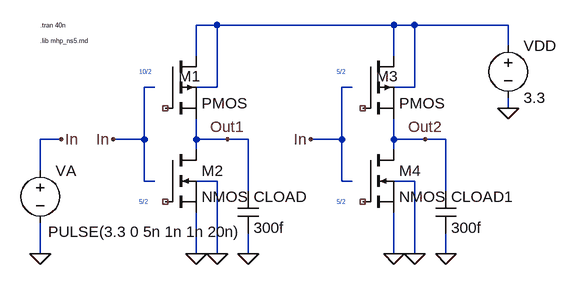
[diagram p0: schematic inv_sym.asc]
inv_sym.asc, the LTspice schematic file:
Version 4
SHEET 1 1292 680
WIRE -592 -96 -624 -96
WIRE -320 -96 -592 -96
WIRE -288 -96 -320 -96
WIRE -144 -96 -288 -96
WIRE -144 -64 -144 -96
WIRE -624 -48 -624 -96
WIRE -320 -48 -320 -96
WIRE -688 0 -704 0
WIRE -592 0 -592 -96
WIRE -592 0 -624 0
WIRE -384 0 -400 0
WIRE -288 0 -288 -96
WIRE -288 0 -320 0
WIRE -144 32 -144 16
WIRE -832 80 -864 80
WIRE -704 80 -704 0
WIRE -704 80 -752 80
WIRE -624 80 -624 48
WIRE -576 80 -624 80
WIRE -544 80 -576 80
WIRE -400 80 -400 0
WIRE -400 80 -448 80
WIRE -320 80 -320 48
WIRE -272 80 -320 80
WIRE -240 80 -272 80
WIRE -624 96 -624 80
WIRE -320 96 -320 80
WIRE -864 128 -864 80
WIRE -704 144 -704 80
WIRE -688 144 -704 144
WIRE -592 144 -624 144
WIRE -400 144 -400 80
WIRE -384 144 -400 144
WIRE -288 144 -320 144
WIRE -544 160 -544 80
WIRE -240 160 -240 80
WIRE -864 256 -864 208
WIRE -624 256 -624 192
WIRE -592 256 -592 144
WIRE -544 256 -544 224
WIRE -320 256 -320 192
WIRE -288 256 -288 144
WIRE -240 256 -240 224
FLAG -624 256 0
FLAG -144 32 0
FLAG -832 80 In
FLAG -592 256 0
FLAG -864 256 0
FLAG -544 256 0
FLAG -752 80 In
FLAG -320 256 0
FLAG -288 256 0
FLAG -240 256 0
FLAG -448 80 In
FLAG -576 80 Out1
FLAG -272 80 Out2
SYMBOL voltage -144 -80 R0
WINDOW 123 0 0 Left 2
WINDOW 39 0 0 Left 2
SYMATTR InstName VDD
SYMATTR Value 3.3
SYMBOL voltage -864 112 R0
WINDOW 123 0 0 Left 2
WINDOW 39 0 0 Left 2
WINDOW 3 12 110 Left 2
SYMATTR Value PULSE(3.3 0 5n 1n 1n 20n)
SYMATTR InstName VA
SYMBOL cap -560 160 R0
SYMATTR InstName CLOAD
SYMATTR Value 300f
SYMBOL pmos -672 -48 R0
WINDOW 0 21 31 Left 2
SYMATTR InstName M1
SYMATTR Value2 l=0.6u w=3u
SYMATTR SpiceModel ""
SYMATTR Value PMOS
SYMBOL nmos -672 96 R0
SYMATTR InstName M2
SYMATTR Value NMOS
SYMATTR Value2 l=0.6u w=1.5u
SYMBOL cap -256 160 R0
SYMATTR InstName CLOAD1
SYMATTR Value 300f
SYMBOL pmos -368 -48 R0
WINDOW 0 21 31 Left 2
SYMATTR InstName M3
SYMATTR Value2 l=0.6u w=1.5u
SYMATTR SpiceModel ""
SYMATTR Value PMOS
SYMBOL nmos -368 96 R0
SYMATTR InstName M4
SYMATTR Value NMOS
SYMATTR Value2 l=0.6u w=1.5u
TEXT -864 -96 Left 0 !.tran 40n
TEXT -864 -72 Left 0 !.lib mhp_ns5.md
TEXT -712 -24 Left 0 ;10/2
TEXT -712 176 Left 0 ;5/2
TEXT -408 -24 Left 0 ;5/2
TEXT -408 176 Left 0 ;5/2

The netlist it stands for:
* inv_sym.asc
VDD N001 0 3.3
VA In 0 PULSE(3.3 0 5n 1n 1n 20n)
CLOAD Out1 0 300f
* M1: PMOS l=0.6u w=3u (symbol pmos not certain, pin order unknown); nets seen at it: N001, Out1
* M2: NMOS l=0.6u w=1.5u (symbol nmos not certain, pin order unknown); nets seen at it: 0, Out1
CLOAD1 Out2 0 300f
* M3: PMOS l=0.6u w=1.5u (symbol pmos not certain, pin order unknown); nets seen at it: N001, Out2
* M4: NMOS l=0.6u w=1.5u (symbol nmos not certain, pin order unknown); nets seen at it: 0, Out2
.tran 40n
.lib mhp_ns5.md
* 10/2
* 5/2
* 5/2
* 5/2
.backanno
.end